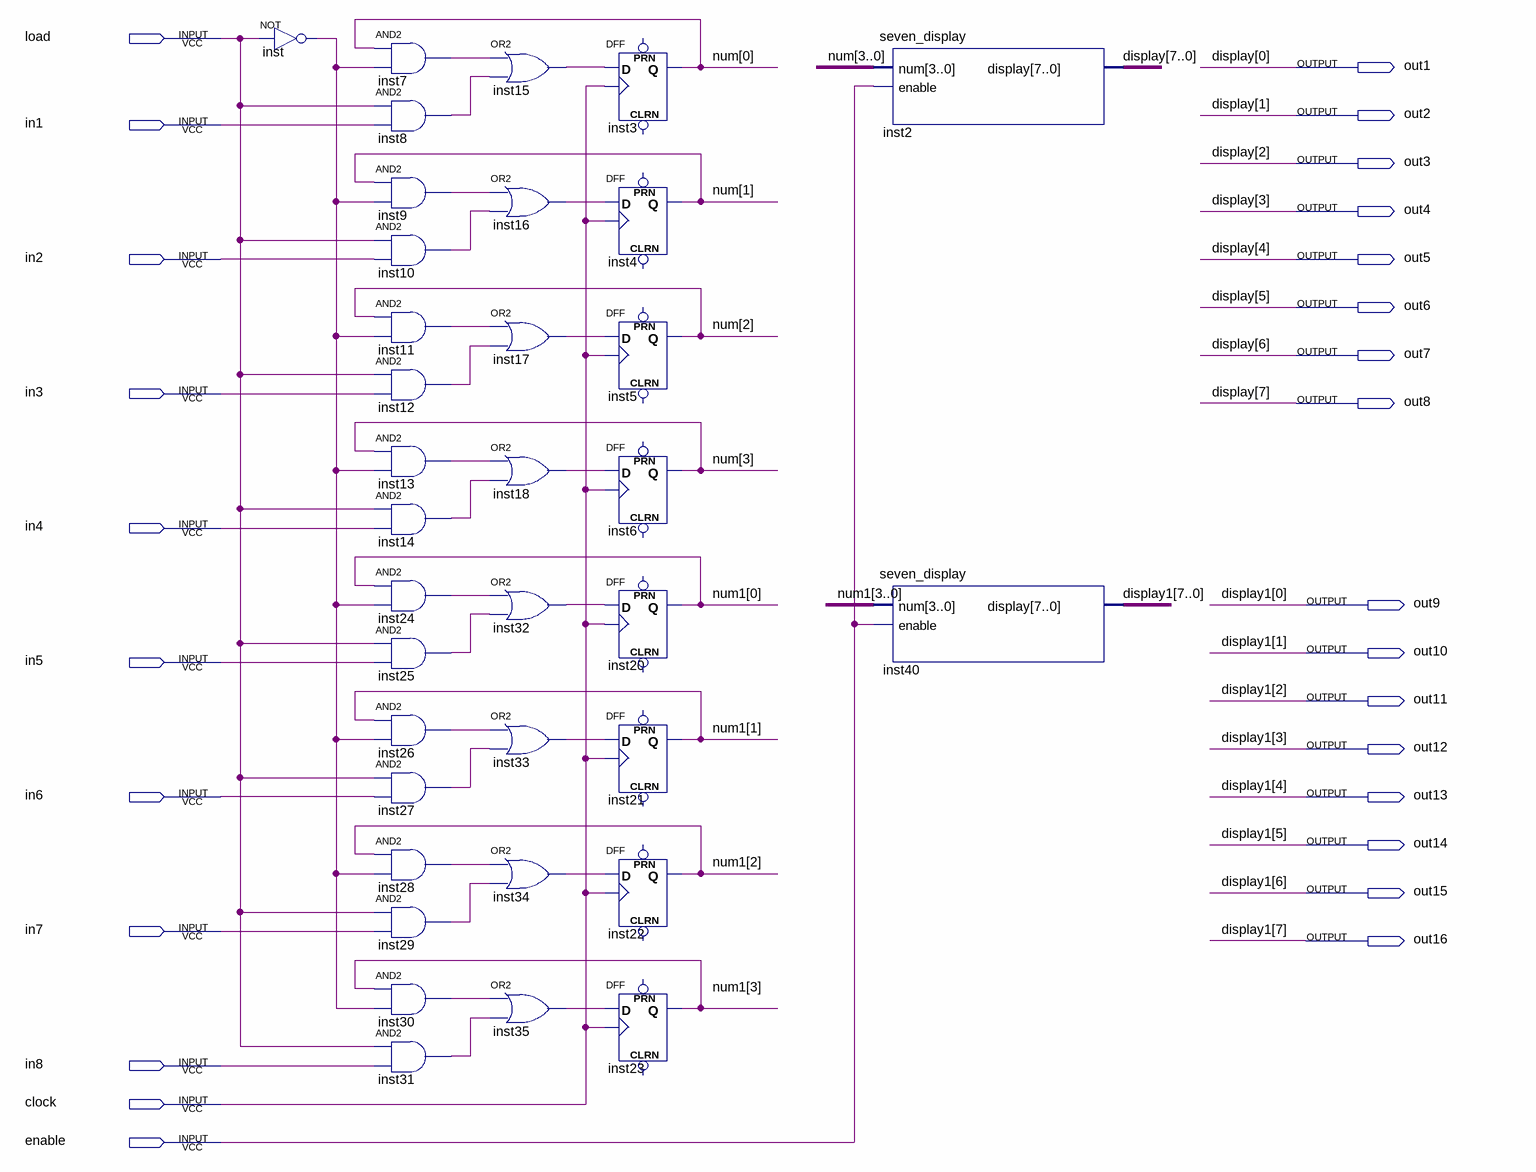
[diagram p0: schematic sheet]
// Quartus schematic lab03.bdf as structural Verilog: 35 symbols, 27 pins
module lab03 (
  input  load,
  input  in1,
  input  in2,
  input  in3,
  input  in4,
  input  in5,
  input  in6,
  input  in7,
  input  in8,
  input  clock,
  input  enable,
  output out1,
  output out2,
  output out3,
  output out4,
  output out5,
  output out6,
  output out7,
  output out8,
  output out9,
  output out10,
  output out11,
  output out12,
  output out13,
  output out14,
  output out15,
  output out16
);

  wire inst7_out, inst8_out, inst9_out, inst10_out, inst11_out, inst12_out, inst13_out, inst14_out,
       inst15_out, inst16_out, inst17_out, inst18_out, inst24_out, inst25_out, inst26_out, inst27_out,
       inst28_out, inst29_out, inst30_out, inst31_out, inst32_out, inst33_out, inst34_out, inst35_out,
       inst_out;
  wire [3:0] num, num1;

  not inst (inst_out, load);
  and inst7 (inst7_out, num[0], inst_out);
  and inst8 (inst8_out, load, in1);
  and inst9 (inst9_out, num[1], inst_out);
  and inst10 (inst10_out, load, in2);
  and inst11 (inst11_out, num[2], inst_out);
  and inst12 (inst12_out, load, in3);
  and inst13 (inst13_out, num[3], inst_out);
  and inst14 (inst14_out, load, in4);
  and inst24 (inst24_out, num1[0], inst_out);
  and inst25 (inst25_out, load, in5);
  and inst26 (inst26_out, num1[1], inst_out);
  and inst27 (inst27_out, load, in6);
  and inst28 (inst28_out, num1[2], inst_out);
  and inst29 (inst29_out, load, in7);
  and inst30 (inst30_out, num1[3], inst_out);
  and inst31 (inst31_out, load, in8);
  or inst15 (inst15_out, inst7_out, inst8_out);
  or inst16 (inst16_out, inst9_out, inst10_out);
  or inst17 (inst17_out, inst11_out, inst12_out);
  or inst18 (inst18_out, inst13_out, inst14_out);
  or inst32 (inst32_out, inst24_out, inst25_out);
  or inst33 (inst33_out, inst26_out, inst27_out);
  or inst34 (inst34_out, inst28_out, inst29_out);
  or inst35 (inst35_out, inst30_out, inst31_out);
  DFF inst3 (.CLK(clock), .D(inst15_out), .Q(num[0]));  // open: CLRN, PRN
  DFF inst4 (.CLK(clock), .D(inst16_out), .Q(num[1]));  // open: CLRN, PRN
  DFF inst5 (.CLK(clock), .D(inst17_out), .Q(num[2]));  // open: CLRN, PRN
  DFF inst6 (.CLK(clock), .D(inst18_out), .Q(num[3]));  // open: CLRN, PRN
  DFF inst20 (.CLK(clock), .D(inst32_out), .Q(num1[0]));  // open: CLRN, PRN
  DFF inst21 (.CLK(clock), .D(inst33_out), .Q(num1[1]));  // open: CLRN, PRN
  DFF inst22 (.CLK(clock), .D(inst34_out), .Q(num1[2]));  // open: CLRN, PRN
  DFF inst23 (.CLK(clock), .D(inst35_out), .Q(num1[3]));  // open: CLRN, PRN
  seven_display inst2 (.num(num), .enable(enable), .display({out8, out7, out6, out5, out4, out3, out2, out1}));
  seven_display inst40 (.num(num1), .enable(enable), .display({out16, out15, out14, out13, out12, out11, out10, out9}));

  // Other names for the same wires on the sheet: display[7:0] = {out8, out7, out6, out5, out4, out3, out2, out1};
  //   display1[7:0] = {out16, out15, out14, out13, out12, out11, out10, out9}
endmodule
